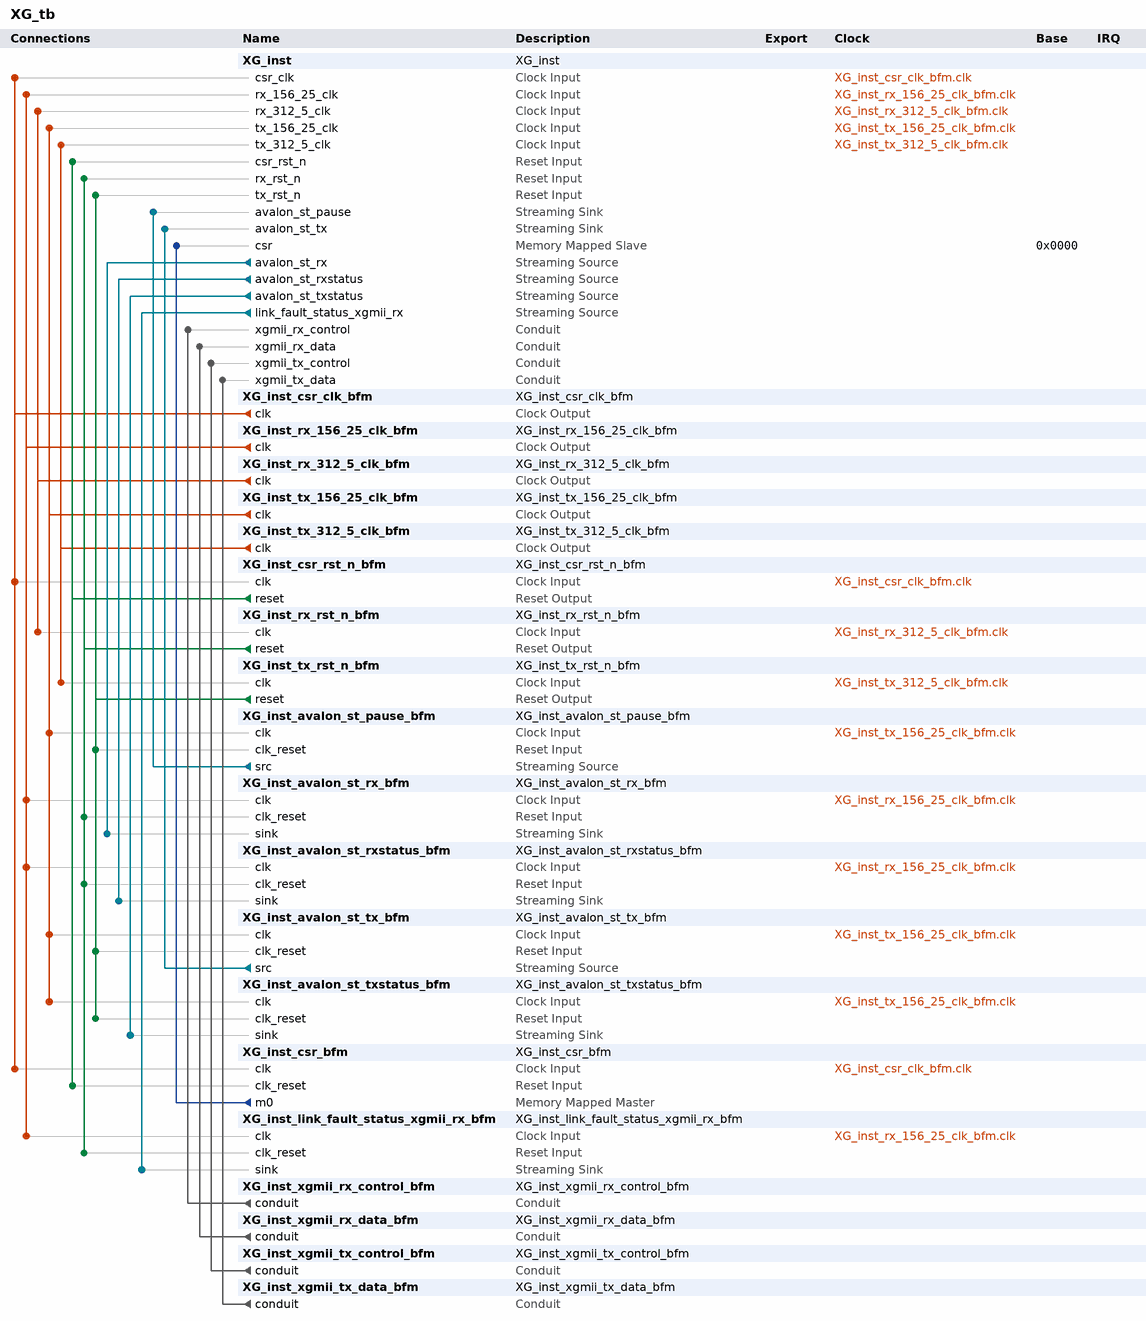
[diagram p0: system contents]
# Platform Designer (Qsys) system XG_tb, Arria 10 10AT115S2F45E2SG
# Parameters at their usual value, and those the tool derives, are not listed.
package require -exact qsys 1.0
create_system XG_tb
set_project_property DEVICE_FAMILY {Arria 10}
set_project_property DEVICE 10AT115S2F45E2SG

add_component XG_inst /home/dai/WorkStation/fpga/project/intel/IPs/XG/XG.ip XG_inst XG_inst 1.0

add_component XG_inst_csr_clk_bfm ip/XG_tb/XG_inst_csr_clk_bfm_ip.ip XG_inst_csr_clk_bfm XG_inst_csr_clk_bfm 1.0
load_component XG_inst_csr_clk_bfm
set_component_parameter_value CLOCK_RATE 50000000
set_component_parameter_value CLOCK_UNIT 1
save_component

add_component XG_inst_rx_156_25_clk_bfm ip/XG_tb/XG_inst_rx_156_25_clk_bfm_ip.ip XG_inst_rx_156_25_clk_bfm XG_inst_rx_156_25_clk_bfm 1.0
load_component XG_inst_rx_156_25_clk_bfm
set_component_parameter_value CLOCK_RATE 50000000
set_component_parameter_value CLOCK_UNIT 1
save_component

add_component XG_inst_rx_312_5_clk_bfm ip/XG_tb/XG_inst_rx_312_5_clk_bfm_ip.ip XG_inst_rx_312_5_clk_bfm XG_inst_rx_312_5_clk_bfm 1.0
load_component XG_inst_rx_312_5_clk_bfm
set_component_parameter_value CLOCK_RATE 50000000
set_component_parameter_value CLOCK_UNIT 1
save_component

add_component XG_inst_tx_156_25_clk_bfm ip/XG_tb/XG_inst_tx_156_25_clk_bfm_ip.ip XG_inst_tx_156_25_clk_bfm XG_inst_tx_156_25_clk_bfm 1.0
load_component XG_inst_tx_156_25_clk_bfm
set_component_parameter_value CLOCK_RATE 50000000
set_component_parameter_value CLOCK_UNIT 1
save_component

add_component XG_inst_tx_312_5_clk_bfm ip/XG_tb/XG_inst_tx_312_5_clk_bfm_ip.ip XG_inst_tx_312_5_clk_bfm XG_inst_tx_312_5_clk_bfm 1.0
load_component XG_inst_tx_312_5_clk_bfm
set_component_parameter_value CLOCK_RATE 50000000
set_component_parameter_value CLOCK_UNIT 1
save_component

add_component XG_inst_csr_rst_n_bfm ip/XG_tb/XG_inst_csr_rst_n_bfm_ip.ip XG_inst_csr_rst_n_bfm XG_inst_csr_rst_n_bfm 1.0
load_component XG_inst_csr_rst_n_bfm
set_component_parameter_value ASSERT_HIGH_RESET 0
set_component_parameter_value INITIAL_RESET_CYCLES 50
save_component

add_component XG_inst_rx_rst_n_bfm ip/XG_tb/XG_inst_rx_rst_n_bfm_ip.ip XG_inst_rx_rst_n_bfm XG_inst_rx_rst_n_bfm 1.0
load_component XG_inst_rx_rst_n_bfm
set_component_parameter_value ASSERT_HIGH_RESET 0
set_component_parameter_value INITIAL_RESET_CYCLES 50
save_component

add_component XG_inst_tx_rst_n_bfm ip/XG_tb/XG_inst_tx_rst_n_bfm_ip.ip XG_inst_tx_rst_n_bfm XG_inst_tx_rst_n_bfm 1.0
load_component XG_inst_tx_rst_n_bfm
set_component_parameter_value ASSERT_HIGH_RESET 0
set_component_parameter_value INITIAL_RESET_CYCLES 50
save_component

add_component XG_inst_avalon_st_pause_bfm ip/XG_tb/XG_inst_avalon_st_pause_bfm_ip.ip XG_inst_avalon_st_pause_bfm XG_inst_avalon_st_pause_bfm 1.0
load_component XG_inst_avalon_st_pause_bfm
set_component_parameter_value USE_PACKET 0
set_component_parameter_value USE_CHANNEL 0
set_component_parameter_value USE_ERROR 0
set_component_parameter_value USE_READY 0
set_component_parameter_value USE_VALID 0
set_component_parameter_value USE_EMPTY 0
set_component_parameter_value ST_SYMBOL_W 2
set_component_parameter_value ST_NUMSYMBOLS 1
set_component_parameter_value ST_CHANNEL_W 1
set_component_parameter_value ST_ERROR_W 1
set_component_parameter_value ST_EMPTY_W 1
set_component_parameter_value ST_READY_LATENCY 0
set_component_parameter_value ST_BEATSPERCYCLE 1
set_component_parameter_value ST_MAX_CHANNELS 0
set_component_parameter_value VHDL_ID 0
save_component

add_component XG_inst_avalon_st_rx_bfm ip/XG_tb/XG_inst_avalon_st_rx_bfm_ip.ip XG_inst_avalon_st_rx_bfm XG_inst_avalon_st_rx_bfm 1.0
load_component XG_inst_avalon_st_rx_bfm
set_component_parameter_value USE_PACKET 1
set_component_parameter_value USE_CHANNEL 0
set_component_parameter_value USE_ERROR 1
set_component_parameter_value USE_READY 1
set_component_parameter_value USE_VALID 1
set_component_parameter_value USE_EMPTY 1
set_component_parameter_value ST_SYMBOL_W 8
set_component_parameter_value ST_NUMSYMBOLS 8
set_component_parameter_value ST_CHANNEL_W 1
set_component_parameter_value ST_ERROR_W 6
set_component_parameter_value ST_EMPTY_W 3
set_component_parameter_value ST_READY_LATENCY 0
set_component_parameter_value ST_BEATSPERCYCLE 1
set_component_parameter_value ST_MAX_CHANNELS 0
set_component_parameter_value VHDL_ID 0
save_component

add_component XG_inst_avalon_st_rxstatus_bfm ip/XG_tb/XG_inst_avalon_st_rxstatus_bfm_ip.ip XG_inst_avalon_st_rxstatus_bfm XG_inst_avalon_st_rxstatus_bfm 1.0
load_component XG_inst_avalon_st_rxstatus_bfm
set_component_parameter_value USE_PACKET 0
set_component_parameter_value USE_CHANNEL 0
set_component_parameter_value USE_ERROR 1
set_component_parameter_value USE_READY 0
set_component_parameter_value USE_VALID 1
set_component_parameter_value USE_EMPTY 0
set_component_parameter_value ST_SYMBOL_W 8
set_component_parameter_value ST_NUMSYMBOLS 5
set_component_parameter_value ST_CHANNEL_W 1
set_component_parameter_value ST_ERROR_W 7
set_component_parameter_value ST_EMPTY_W 3
set_component_parameter_value ST_READY_LATENCY 0
set_component_parameter_value ST_BEATSPERCYCLE 1
set_component_parameter_value ST_MAX_CHANNELS 0
set_component_parameter_value VHDL_ID 1
save_component

add_component XG_inst_avalon_st_tx_bfm ip/XG_tb/XG_inst_avalon_st_tx_bfm_ip.ip XG_inst_avalon_st_tx_bfm XG_inst_avalon_st_tx_bfm 1.0
load_component XG_inst_avalon_st_tx_bfm
set_component_parameter_value USE_PACKET 1
set_component_parameter_value USE_CHANNEL 0
set_component_parameter_value USE_ERROR 1
set_component_parameter_value USE_READY 1
set_component_parameter_value USE_VALID 1
set_component_parameter_value USE_EMPTY 1
set_component_parameter_value ST_SYMBOL_W 8
set_component_parameter_value ST_NUMSYMBOLS 8
set_component_parameter_value ST_CHANNEL_W 1
set_component_parameter_value ST_ERROR_W 1
set_component_parameter_value ST_EMPTY_W 3
set_component_parameter_value ST_READY_LATENCY 0
set_component_parameter_value ST_BEATSPERCYCLE 1
set_component_parameter_value ST_MAX_CHANNELS 0
set_component_parameter_value VHDL_ID 1
save_component

add_component XG_inst_avalon_st_txstatus_bfm ip/XG_tb/XG_inst_avalon_st_txstatus_bfm_ip.ip XG_inst_avalon_st_txstatus_bfm XG_inst_avalon_st_txstatus_bfm 1.0
load_component XG_inst_avalon_st_txstatus_bfm
set_component_parameter_value USE_PACKET 0
set_component_parameter_value USE_CHANNEL 0
set_component_parameter_value USE_ERROR 1
set_component_parameter_value USE_READY 0
set_component_parameter_value USE_VALID 1
set_component_parameter_value USE_EMPTY 0
set_component_parameter_value ST_SYMBOL_W 8
set_component_parameter_value ST_NUMSYMBOLS 5
set_component_parameter_value ST_CHANNEL_W 1
set_component_parameter_value ST_ERROR_W 7
set_component_parameter_value ST_EMPTY_W 3
set_component_parameter_value ST_READY_LATENCY 0
set_component_parameter_value ST_BEATSPERCYCLE 1
set_component_parameter_value ST_MAX_CHANNELS 0
set_component_parameter_value VHDL_ID 2
save_component

add_component XG_inst_csr_bfm ip/XG_tb/XG_inst_csr_bfm_ip.ip XG_inst_csr_bfm XG_inst_csr_bfm 1.0
load_component XG_inst_csr_bfm
set_component_parameter_value AV_ADDRESS_W 10
set_component_parameter_value AV_SYMBOL_W 8
set_component_parameter_value AV_NUMSYMBOLS 4
set_component_parameter_value AV_BURSTCOUNT_W 1
set_component_parameter_value AV_READRESPONSE_W 1
set_component_parameter_value AV_WRITERESPONSE_W 1
set_component_parameter_value USE_READ 1
set_component_parameter_value USE_WRITE 1
set_component_parameter_value USE_ADDRESS 1
set_component_parameter_value USE_BYTE_ENABLE 0
set_component_parameter_value USE_BURSTCOUNT 0
set_component_parameter_value USE_READ_DATA 1
set_component_parameter_value USE_READ_DATA_VALID 0
set_component_parameter_value USE_WRITE_DATA 1
set_component_parameter_value USE_BEGIN_TRANSFER 0
set_component_parameter_value USE_BEGIN_BURST_TRANSFER 0
set_component_parameter_value USE_ARBITERLOCK 0
set_component_parameter_value USE_LOCK 0
set_component_parameter_value USE_DEBUGACCESS 0
set_component_parameter_value USE_WAIT_REQUEST 1
set_component_parameter_value USE_TRANSACTIONID 0
set_component_parameter_value USE_WRITERESPONSE 0
set_component_parameter_value USE_READRESPONSE 0
set_component_parameter_value USE_CLKEN 0
set_component_parameter_value ASSERT_HIGH_RESET 1
set_component_parameter_value ASSERT_HIGH_WAITREQUEST 1
set_component_parameter_value ASSERT_HIGH_READ 1
set_component_parameter_value ASSERT_HIGH_WRITE 1
set_component_parameter_value ASSERT_HIGH_BYTEENABLE 1
set_component_parameter_value ASSERT_HIGH_READDATAVALID 1
set_component_parameter_value ASSERT_HIGH_ARBITERLOCK 1
set_component_parameter_value ASSERT_HIGH_LOCK 1
set_component_parameter_value AV_CONSTANT_BURST_BEHAVIOR 1
set_component_parameter_value AV_BURST_LINEWRAP 0
set_component_parameter_value AV_BURST_BNDR_ONLY 0
set_component_parameter_value AV_ALWAYS_BURST_MAX_BURST 0
set_component_parameter_value AV_MAX_PENDING_READS 0
set_component_parameter_value AV_MAX_PENDING_WRITES 0
set_component_parameter_value AV_FIX_READ_LATENCY 1
set_component_parameter_value AV_READ_WAIT_TIME 0
set_component_parameter_value AV_WRITE_WAIT_TIME 0
set_component_parameter_value AV_WAITREQUEST_ALLOWANCE 0
set_component_parameter_value REGISTER_WAITREQUEST 0
set_component_parameter_value AV_REGISTERINCOMINGSIGNALS 0
set_component_parameter_value ADDRESS_UNITS WORDS
set_component_parameter_value VHDL_ID 0
save_component

add_component XG_inst_link_fault_status_xgmii_rx_bfm ip/XG_tb/XG_inst_link_fault_status_xgmii_rx_bfm_ip.ip XG_inst_link_fault_status_xgmii_rx_bfm XG_inst_link_fault_status_xgmii_rx_bfm 1.0
load_component XG_inst_link_fault_status_xgmii_rx_bfm
set_component_parameter_value USE_PACKET 0
set_component_parameter_value USE_CHANNEL 0
set_component_parameter_value USE_ERROR 0
set_component_parameter_value USE_READY 0
set_component_parameter_value USE_VALID 0
set_component_parameter_value USE_EMPTY 0
set_component_parameter_value ST_SYMBOL_W 2
set_component_parameter_value ST_NUMSYMBOLS 1
set_component_parameter_value ST_CHANNEL_W 1
set_component_parameter_value ST_ERROR_W 1
set_component_parameter_value ST_EMPTY_W 1
set_component_parameter_value ST_READY_LATENCY 0
set_component_parameter_value ST_BEATSPERCYCLE 1
set_component_parameter_value ST_MAX_CHANNELS 0
set_component_parameter_value VHDL_ID 3
save_component

add_component XG_inst_xgmii_rx_control_bfm ip/XG_tb/XG_inst_xgmii_rx_control_bfm_ip.ip XG_inst_xgmii_rx_control_bfm XG_inst_xgmii_rx_control_bfm 1.0
load_component XG_inst_xgmii_rx_control_bfm
set_component_parameter_value CLOCKED_SIGNAL false
set_component_parameter_value ENABLE_RESET false
set_component_parameter_value SIGNAL_ROLES export
set_component_parameter_value SIGNAL_WIDTHS 4
set_component_parameter_value SIGNAL_DIRECTIONS output
save_component

add_component XG_inst_xgmii_rx_data_bfm ip/XG_tb/XG_inst_xgmii_rx_data_bfm_ip.ip XG_inst_xgmii_rx_data_bfm XG_inst_xgmii_rx_data_bfm 1.0
load_component XG_inst_xgmii_rx_data_bfm
set_component_parameter_value CLOCKED_SIGNAL false
set_component_parameter_value ENABLE_RESET false
set_component_parameter_value SIGNAL_ROLES export
set_component_parameter_value SIGNAL_WIDTHS 32
set_component_parameter_value SIGNAL_DIRECTIONS output
save_component

add_component XG_inst_xgmii_tx_control_bfm ip/XG_tb/XG_inst_xgmii_tx_control_bfm_ip.ip XG_inst_xgmii_tx_control_bfm XG_inst_xgmii_tx_control_bfm 1.0
load_component XG_inst_xgmii_tx_control_bfm
set_component_parameter_value CLOCKED_SIGNAL false
set_component_parameter_value ENABLE_RESET false
set_component_parameter_value SIGNAL_ROLES export
set_component_parameter_value SIGNAL_WIDTHS 4
set_component_parameter_value SIGNAL_DIRECTIONS input
save_component

add_component XG_inst_xgmii_tx_data_bfm ip/XG_tb/XG_inst_xgmii_tx_data_bfm_ip.ip XG_inst_xgmii_tx_data_bfm XG_inst_xgmii_tx_data_bfm 1.0
load_component XG_inst_xgmii_tx_data_bfm
set_component_parameter_value CLOCKED_SIGNAL false
set_component_parameter_value ENABLE_RESET false
set_component_parameter_value SIGNAL_ROLES export
set_component_parameter_value SIGNAL_WIDTHS 32
set_component_parameter_value SIGNAL_DIRECTIONS input
save_component

# connections
add_connection XG_inst_csr_clk_bfm.clk XG_inst.csr_clk clock
add_connection XG_inst_csr_clk_bfm.clk XG_inst_csr_bfm.clk clock
add_connection XG_inst_csr_clk_bfm.clk XG_inst_csr_rst_n_bfm.clk clock
add_connection XG_inst_rx_156_25_clk_bfm.clk XG_inst.rx_156_25_clk clock
add_connection XG_inst_rx_156_25_clk_bfm.clk XG_inst_avalon_st_rx_bfm.clk clock
add_connection XG_inst_rx_156_25_clk_bfm.clk XG_inst_avalon_st_rxstatus_bfm.clk clock
add_connection XG_inst_rx_156_25_clk_bfm.clk XG_inst_link_fault_status_xgmii_rx_bfm.clk clock
add_connection XG_inst_rx_312_5_clk_bfm.clk XG_inst.rx_312_5_clk clock
add_connection XG_inst_rx_312_5_clk_bfm.clk XG_inst_rx_rst_n_bfm.clk clock
add_connection XG_inst_tx_156_25_clk_bfm.clk XG_inst.tx_156_25_clk clock
add_connection XG_inst_tx_156_25_clk_bfm.clk XG_inst_avalon_st_pause_bfm.clk clock
add_connection XG_inst_tx_156_25_clk_bfm.clk XG_inst_avalon_st_tx_bfm.clk clock
add_connection XG_inst_tx_156_25_clk_bfm.clk XG_inst_avalon_st_txstatus_bfm.clk clock
add_connection XG_inst_tx_312_5_clk_bfm.clk XG_inst.tx_312_5_clk clock
add_connection XG_inst_tx_312_5_clk_bfm.clk XG_inst_tx_rst_n_bfm.clk clock
add_connection XG_inst_csr_rst_n_bfm.reset XG_inst.csr_rst_n reset
add_connection XG_inst_csr_rst_n_bfm.reset XG_inst_csr_bfm.clk_reset reset
add_connection XG_inst_rx_rst_n_bfm.reset XG_inst.rx_rst_n reset
add_connection XG_inst_rx_rst_n_bfm.reset XG_inst_avalon_st_rx_bfm.clk_reset reset
add_connection XG_inst_rx_rst_n_bfm.reset XG_inst_avalon_st_rxstatus_bfm.clk_reset reset
add_connection XG_inst_rx_rst_n_bfm.reset XG_inst_link_fault_status_xgmii_rx_bfm.clk_reset reset
add_connection XG_inst_tx_rst_n_bfm.reset XG_inst.tx_rst_n reset
add_connection XG_inst_tx_rst_n_bfm.reset XG_inst_avalon_st_pause_bfm.clk_reset reset
add_connection XG_inst_tx_rst_n_bfm.reset XG_inst_avalon_st_tx_bfm.clk_reset reset
add_connection XG_inst_tx_rst_n_bfm.reset XG_inst_avalon_st_txstatus_bfm.clk_reset reset
add_connection XG_inst_csr_bfm.m0 XG_inst.csr avalon
set_connection_parameter_value XG_inst_csr_bfm.m0/XG_inst.csr baseAddress 0x0000
add_connection XG_inst.avalon_st_rx XG_inst_avalon_st_rx_bfm.sink avalon_streaming
add_connection XG_inst.avalon_st_rxstatus XG_inst_avalon_st_rxstatus_bfm.sink avalon_streaming
add_connection XG_inst.avalon_st_txstatus XG_inst_avalon_st_txstatus_bfm.sink avalon_streaming
add_connection XG_inst.link_fault_status_xgmii_rx XG_inst_link_fault_status_xgmii_rx_bfm.sink avalon_streaming
add_connection XG_inst_avalon_st_pause_bfm.src XG_inst.avalon_st_pause avalon_streaming
add_connection XG_inst_avalon_st_tx_bfm.src XG_inst.avalon_st_tx avalon_streaming
add_connection XG_inst_xgmii_rx_control_bfm.conduit XG_inst.xgmii_rx_control conduit
add_connection XG_inst_xgmii_rx_data_bfm.conduit XG_inst.xgmii_rx_data conduit
add_connection XG_inst_xgmii_tx_control_bfm.conduit XG_inst.xgmii_tx_control conduit
add_connection XG_inst_xgmii_tx_data_bfm.conduit XG_inst.xgmii_tx_data conduit

set_interconnect_requirement {$system} qsys_mm.clockCrossingAdapter HANDSHAKE
set_interconnect_requirement {$system} qsys_mm.enableEccProtection FALSE
set_interconnect_requirement {$system} qsys_mm.insertDefaultSlave FALSE
set_interconnect_requirement {$system} qsys_mm.maxAdditionalLatency 1

save_system XG_tb.qsys
